# EAGLE design brick_3pin_led_mini (EAGLE 7.4.0)
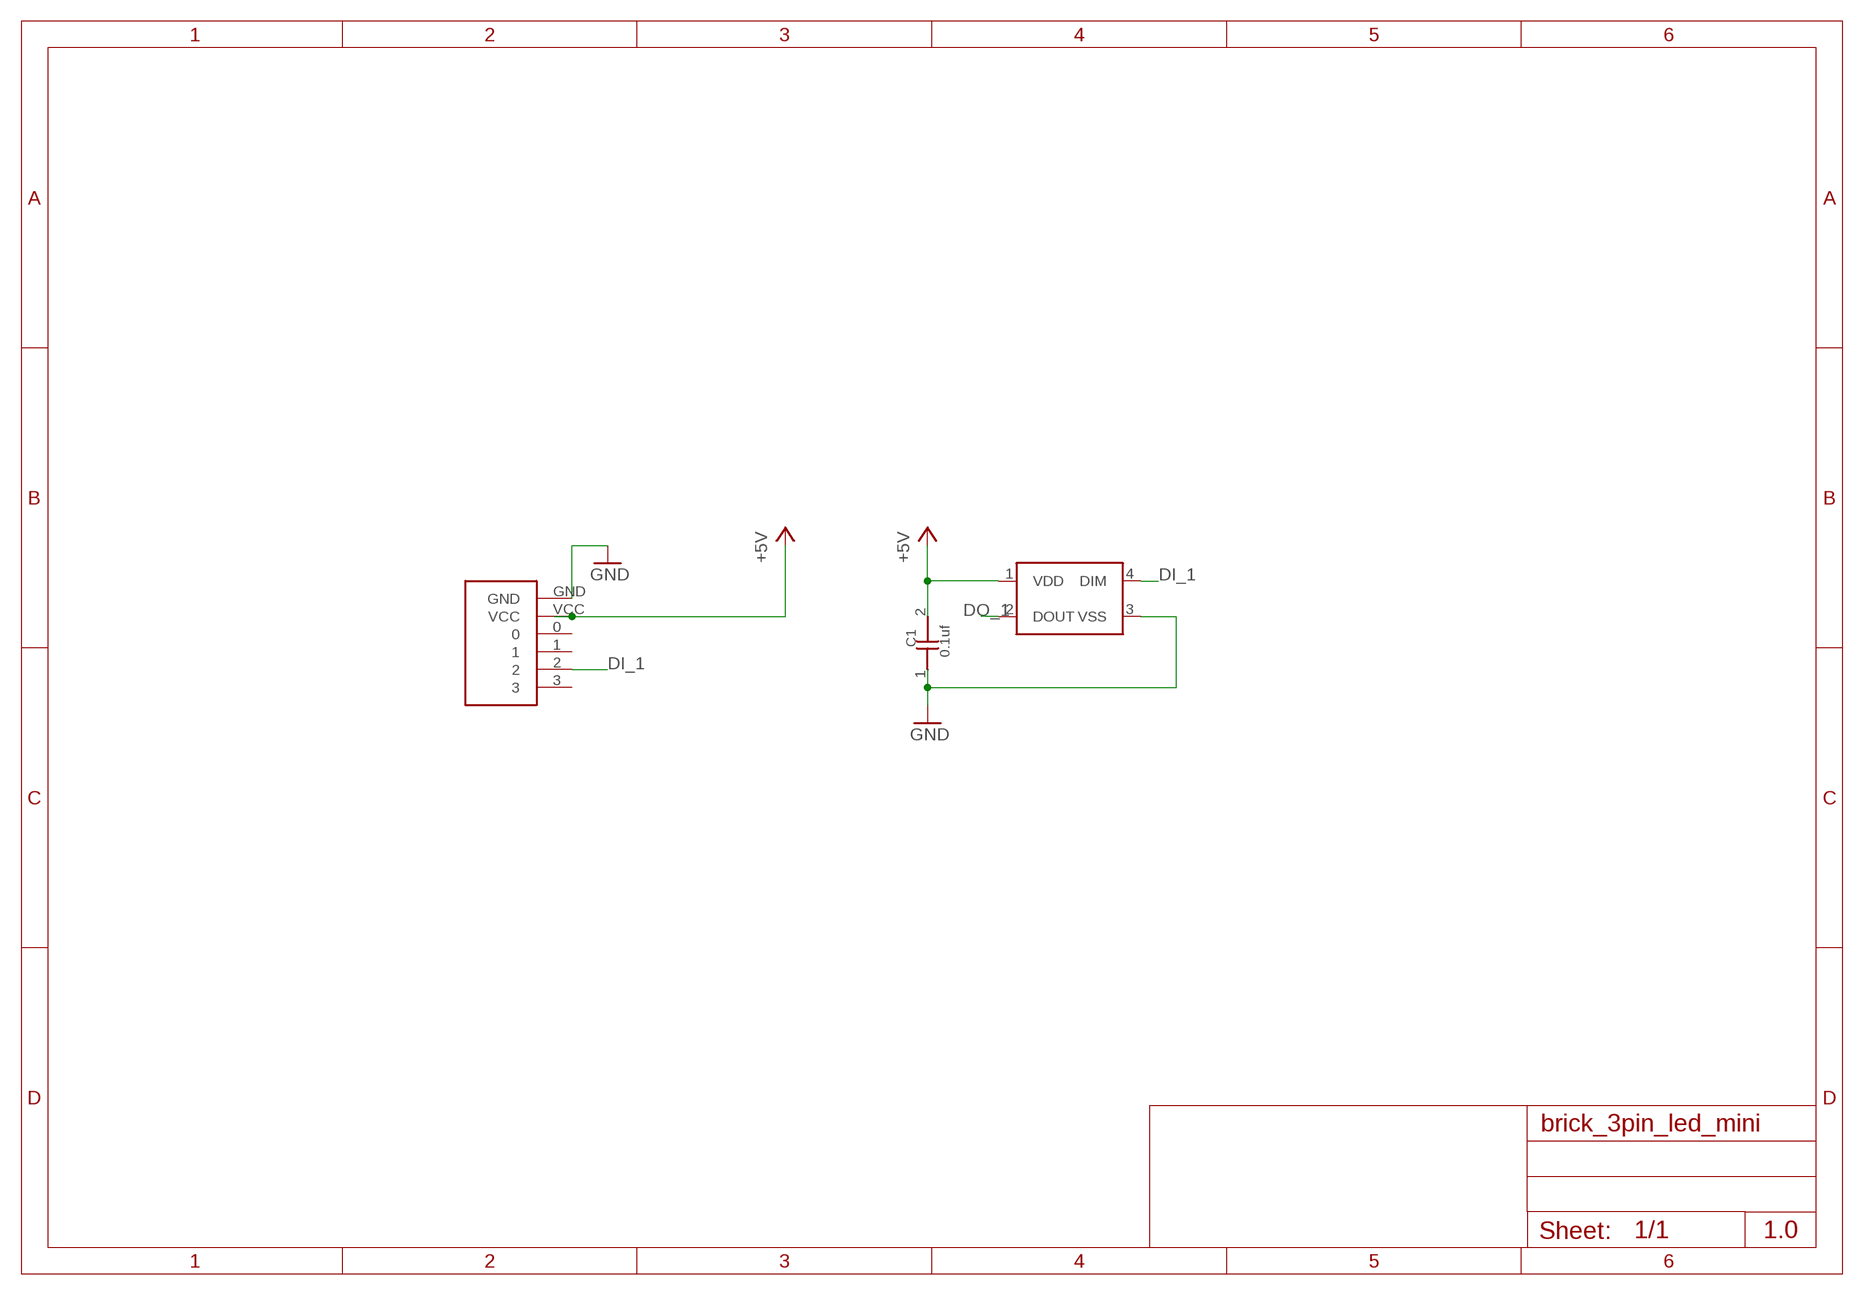
[diagram p0: schematic, sheet 1]

## Parts
C1  0.1uf  CAPACITOR0603  [0603]
LED1  WS2818B  [WS2818B]
U$2  FABO-NANO  [FABO-NANO]

## Nets
+5V: C1.2 LED1.1(VDD) U$2.VCC
DI_1: LED1.4(DIM) U$2.2
DO_1: LED1.2(DOUT)
GND: C1.1 LED1.3(VSS) U$2.GND
Unconnected: U$2.0 U$2.1 U$2.3

## Notes on the sheet
- 1.0

## Library data of the parts
C1 = GClue-Capacitor:CAPACITOR
LED1 = GClue-LED:WS2818B
U$2 = FaBo-Template:FABO-NANO

## Board
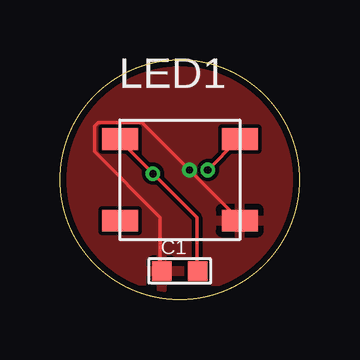
[diagram p1: board, top side]
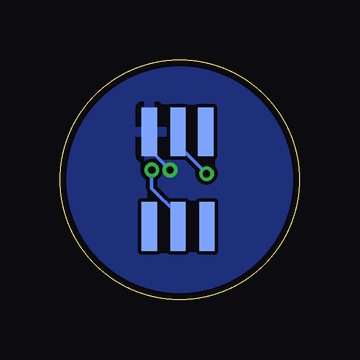
[diagram p2: board, bottom side, seen from below]

Size 10 x 10 mm. Coordinates in mm from the lower left corner, seen from the top.
Copper layers (1*16): Top 0.035mm / dielectric 1.5mm / Bottom 0.035mm
Design rules "SeeedStudio_2layer_DRU_no_angle_20140221": minimum track width 6mil, minimum drill 12mil, track to track 6mil, track to pad 6mil, pad to pad 6mil, via to via 6mil, smd to smd 0mil, copper to edge 10mil, drill to drill 10mil, minimum pad ring 10mil, minimum via ring 6mil, stop-mask expansion 2mil, vias tented up to drill 100mil, thermal gap 10mil

### Footprints (pad centres in the part's own frame; a part is rotated, then mirrored left to right if it is on the bottom)
0603 = smd 0.8 x 0.8: 1 -0.75,0; 2 0.75,0
WS2818B = smd 1.5 x 0.9: 1 -2.5,1.7; 2 -2.5,-1.7; 3 2.5,-1.7; 4 2.5,1.7
FABO-NANO = smd 0.635 x 2.032 bottom: 0 -1.08,2; 1 1.27,-1.95; 2 0.07,-1.95; 3 -1.13,-1.95; GND 1.27,2; VCC 0.07,2

### Placement (x,y rotation side)
C1  5,1.19 0 top
LED1  5,5 0 top
U$2  5,5 0 top

### Tracks (layer width: path | path; a pad name or v marks a point on that pad's centre or on a via)
+5V  (via drill 0.3)
  Top 0.152: C1.2 5.71,1.29 5.71,3.42 v3.88,5.25 2.51,6.63 LED1.1
  Bottom 0.152: v3.88,5.25 4.95,6.32 4.95,6.93 U$2.VCC
DI_1  (via drill 0.3)
  Top 0.152: v6.17,5.41 7.39,6.63 LED1.4
  Bottom 0.152: v6.17,5.41 6.17,4.64 5.1,3.58 5.1,3.12 U$2.2
GND  (via drill 0.3)
  Top 0.152: C1.1 4.19,1.29 4.19,3.42 1.44,6.17 1.44,7.24 1.6,7.39 3.42,7.39 v5.41,5.41 7.39,3.42 LED1.3
  Bottom 0.152: v5.41,5.41 6.17,6.17 6.17,6.93 U$2.GND
  pour Top: -0.08,-0.08 10.08,-0.08 10.08,10.08 -0.08,10.08
  pour Bottom: -0.08,-0.08 10.08,-0.08 10.08,10.08 -0.08,10.08